# Altium schematic sheet IGBT_Driver.SchDoc
size A; SheetNumber: 2; SheetTotal: 4
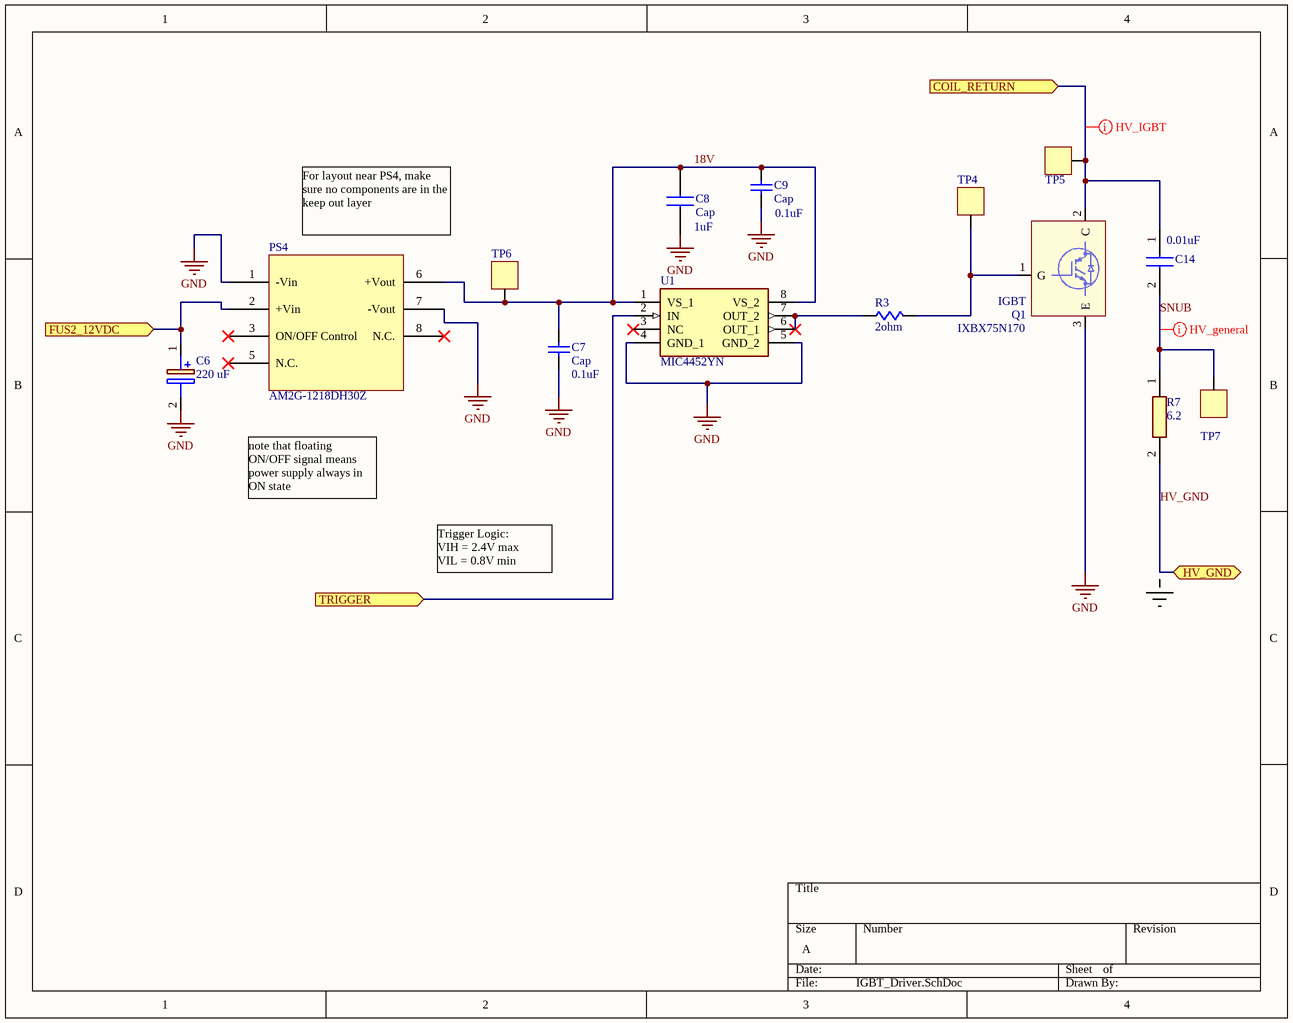
[diagram p0: IGBT_Driver.SchDoc]

## Parts
C6  220 uF  [CAPPRD750W85D1600H2700]
C7  Cap  value 0.1uF  [RAD-0.3]
C8  Cap  [MKS2D041001K00KSSD]
C9  Cap  value 0.1uF  [RAD-0.3]
C14  0.01uF  [FKP1U021006B00MSC9]
PS4  AM2G-1218DH30Z  [AM2G-1218DH30Z]
Q1  IXBX75N170  [TO545P521X1594X2566-3P]
R3  2ohm  [F2W2D0]
R7  6.2  [RESAD1700W60L700D250]
TP4  5261  [5261]  (value not drawn)
TP5  5261  [5261]  (value not drawn)
TP6  5261  [5261]  (value not drawn)
TP7  5261  [5261]  (value not drawn)
U1  MIC4452YN  [DIP762W57P254L952H343Q8N]

## Ports
COIL_RETURN (in), FUS2_12VDC (in), HV_GND (bidir), TRIGGER (in)

## Nets
GND: C6.2(-) C7.1 C8.2 C9.1 PS4.1(-Vin) PS4.7(-Vout) Q1.3(E) U1.4(GND_1) U1.5(GND_2)
18V: C7.2 C8.1 C9.2 PS4.6(+Vout) TP6.1 U1.1(VS_1) U1.8(VS_2)
COIL_RETURN: C14.1 Q1.2(C) TP5.1 ; port COIL_RETURN
FUS2_12VDC: C6.1(+) PS4.2(+Vin) ; port FUS2_12VDC
HV_GND: R7.2 ; port HV_GND
SNUB: C14.2 R7.1 TP7.1
TRIGGER: U1.2(IN) ; port TRIGGER
NetQ1_1: Q1.1(G) R3.2 TP4.1
NetR3_1: R3.1 U1.6(OUT_1) U1.7(OUT_2)

Not connected (* = marked no-connect by the designer): PS4 3(ON/OFF_Control)* 5(N.C.)* 8(N.C.)*; U1 3(NC)*

## Layout directives
net class HV_general: SNUB
net class HV_IGBT: COIL_RETURN

## Notes on the sheet
- (near PS4) For layout near PS4, make sure no components are in the keep out layer
- (near C8) 1uF
- note that floating ON/OFF signal means power supply always in ON state
- Trigger Logic:
  VIH = 2.4V max
  VIL = 0.8V min
- (in symbol IXBX75N170) IGBT

## Library data of the parts
C6 = EEU-FS2A221B: Capacitor Polarised 100VDC 220uF 1800mA EEU-FS2A221B; Manufacturer_Name: Panasonic; Datasheet Link: http://industrial.panasonic.com/cdbs/www-data/pdf/RDF0000/ABA0000C1255.pdf; Height: 27mm; Manufacturer_Part_Number: EEU-FS2A221B; Mouser Part Number: 667-EEU-FS2A221B; Mouser Price/Stock: https://www.mouser.co.uk/ProductDetail/Panasonic/EEU-FS2A221B?qs=w%2Fv1CP2dgqqAbg7G%252BWfZEw%3D%3D; Arrow Part Number: EEU-FS2A221B; Arrow Price/Stock: https://www.arrow.com/en/products/eeu-fs2a221b/panasonic
C7 = Cap: Capacitor 0.1 µF ±10% 100V Ceramic Capacitor X7R Axial SA301C104KAA; Published: 8-Jun-2000; LatestRevisionDate: 17-Jul-2002; LatestRevisionNote: Re-released for DXP Platform.; PackageReference: RAD-0.3; Publisher: Altium Limited; PackageDescription: Radial Cap, Thru-Hole; 2 Leads; 0.3 in Pin Spacing
C8 = MKS2D041001K00KSSD: Capacitor; Manufacturer_Name: WIMA; Datasheet Link: https://componentsearchengine.com/Datasheets/2/MKS2D041001K00KSSD.pdf; Height: 13mm; Manufacturer_Part_Number: MKS2D041001K00KSSD
C9 = Cap: Capacitor Capacitor 0.1 µF ±10% 100V Ceramic Capacitor X7R Axial SA301C104KAA; Published: 8-Jun-2000; LatestRevisionDate: 17-Jul-2002; LatestRevisionNote: Re-released for DXP Platform.; PackageReference: RAD-0.3; Publisher: Altium Limited; PackageDescription: Radial Cap, Thru-Hole; 2 Leads; 0.3 in Pin Spacing
C14 = FKP1U021006B00MSC9: Capacitor; Manufacturer_Name: WIMA; Datasheet Link: https://www.mouser.com/datasheet/2/440/e_WIMA_FKP_1-1139839.pdf; Height: 21mm; Manufacturer_Part_Number: FKP1U021006B00MSC9
Q1 = IXBX75N170: Transistor IGBT; Manufacturer_Name: IXYS SEMICONDUCTOR; Datasheet Link: https://www.littelfuse.com/~/media/electronics/datasheets/discrete_igbts/littelfuse_discrete_igbts_bimosfet_ixb_75n170_datasheet.pdf.pdf; Height: 5.21mm; Manufacturer_Part_Number: IXBX75N170; Mouser Part Number: 747-IXBX75N170; Mouser Price/Stock: https://www.mouser.co.uk/ProductDetail/IXYS/IXBX75N170?qs=6UKyFUzHTllWMFJjywXaHA%3D%3D
R3 = F2W2D0: RES TH 2 OHM 5% 2W AXIAL
R7 = OD62GJE: Resistor; Manufacturer_Name: Ohmite; Datasheet Link: https://www.ohmite.com/assets/docs/res_od_of_oa.pdf; Manufacturer_Part_Number: OD62GJE
TP4-TP7 = 5261: TEST POINT grabber (BLACK) - MINIATURE